# Altium schematic sheet DS1307.SchDoc
size A4; Organization: My Company; Address1: Address Line 1; Address2: Address Line 2; Address3: Address Line 3; Address4: Address Line 4; SheetNumber: 4; SheetTotal: 5
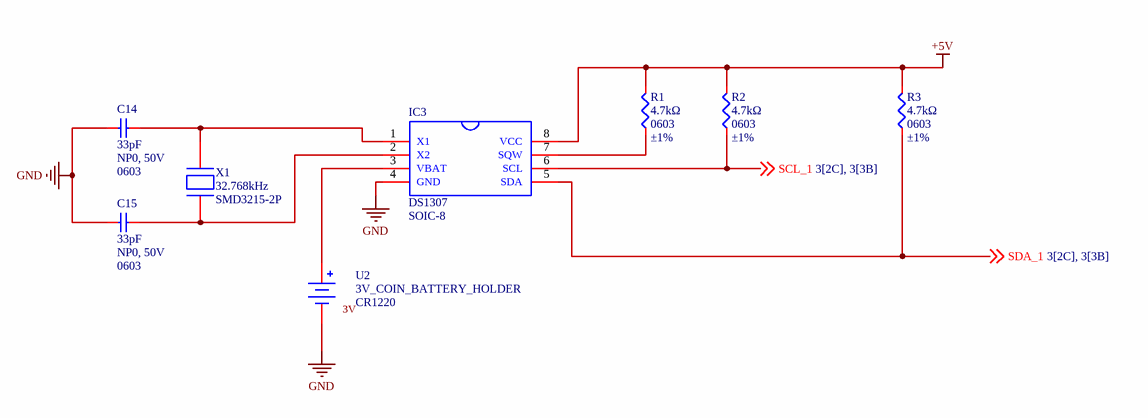
[diagram p0: DS1307.SchDoc]

## Parts
C14  33pF  Temperature Coefficient: NP0, 50V  Package: 0603  [C0603]
C15  33pF  Temperature Coefficient: NP0, 50V  Package: 0603  [C0603]
IC3  DS1307  [SOIC-8]
R1  4.7kΩ  Package: 0603  Tolerance: ±1%  [R0603]
R2  4.7kΩ  Package: 0603  Tolerance: ±1%  [R0603]
R3  4.7kΩ  Package: 0603  Tolerance: ±1%  [R0603]
U2  3V_COIN_BATTERY_HOLDER  Battery Type: CR1220  [3V_COIN_BATERRY_HOLDER_CR1220]
X1  32.768kHz  [SMD3215-2P]

## Nets
+5V: IC3.8(VCC) R1.2 R2.2 R3.2
GND: C14.2 C15.2 IC3.4(GND) U2.2
SCL_1: IC3.6(SCL) R2.1 ; off-sheet SCL_1
SDA_1: IC3.5(SDA) R3.1 ; off-sheet SDA_1
NetC14_1: C14.1 IC3.1(X1) X1.2
NetC15_1: C15.1 IC3.2(X2) X1.1
NetIC3_3: IC3.3(VBAT) U2.1
NetIC3_7: IC3.7(SQW) R1.1

## Notes on the sheet
- Author:
- Title:
- Size:
- A4
- Project:
- Approved:
- Revision:
- Modified Date:
- CONFIDENTIAL
- Date:
- SW Version:
- (in symbol 3V_COIN_BATTERY_HOLDER) 3V

## Library data of the parts
C14 C15 = C0603_MLCC_33pF_NP0_50V: 50V 33pF NP0 ±5% 0603 Multilayer Ceramic Capacitors MLCC - SMD/SMT ROHS; Manufacturer: YAGEO; Mfr. Part: CC0603JRNPO9BN330; LCSC Part: C107047; Capacitance: 33pF; Link: https://www.lcsc.com/product-detail/C107047.html; Tolerance: ±5%; Voltage Rating: 50V
IC3 = DS1307-SOIC8: I2C SOIC-8 Real Time Clocks ROHS; Manufacturer: MAXIM; Mfr. Part: DS1307Z+T&R; Key Attributes: 64 x 8, Serial, I²C Real-Time Clock; LCSC Part: C9868; Link: https://www.lcsc.com/product-detail/C9868.html?s_z=n_DS1307; Interface: I2C; Package: SOIC-8
R1-R3 = R0603_4.7kΩ_±1%: 100mW Thick Film Resistor 75V ±100ppm/℃ ±1% 4.7kΩ 0603 Chip Resistor - Surface Mount ROHS; Manufacturer: YAGEO; Mfr. Part: RC0603FR-074K7L; LCSC Part: C99782; Resistance: 4.7kΩ; Operating Temperature: -55℃~+155℃; Link: https://www.lcsc.com/product-detail/C99782.html
U2 = 3V_COIN_BATTERY_HOLDER: Battery Holder -25℃~+85℃ Phosphor Bronze CR1220 SMD Button And Strip Battery Connector ROHS; Manufacturer: MYOUNG; Mfr. Part: BS-12-B3AA003; LCSC Part: C964723; Package: SMD; Link: https://www.lcsc.com/product-detail/C964723.html
X1 = Crystal_32.768Khz: 32.768kHz 12.5pF ±20ppm SMD3215-2P Crystals ROHS; Manufacturer: NDK; Mfr. Part: NX3215SA-32.768K-STD-MUA-8; LCSC Part: C156245; Frequency: 32.768kHz; Type: -; Load Capacitance: 12.5pF; Frequency Stability: -; Operating Temperature: -40℃~+85℃; Link: https://www.lcsc.com/product-detail/C156245.html?s_z=n_Crystal%252032%252C768kHz; Package: SMD3215-2P